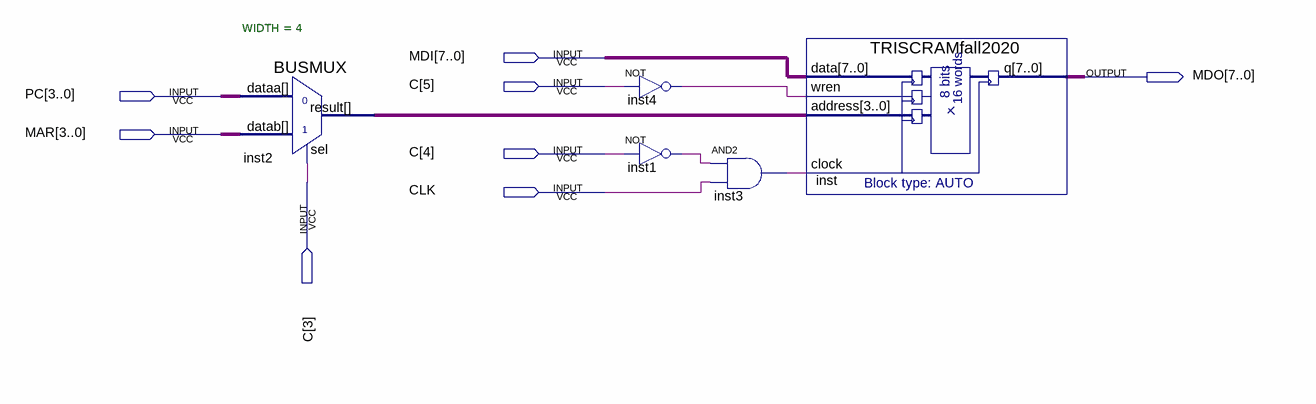
[diagram p0: schematic sheet]
// Quartus schematic TRISCRAM.bdf as structural Verilog: 5 symbols, 8 pins
module TRISCRAM (
  input  [7:0] MDI,
  input  [5:3] C,
  input  [3:0] PC,
  input  [3:0] MAR,
  input  CLK,
  output [7:0] MDO
);

  wire inst1_out, inst3_out, inst4_out;
  wire [3:0] inst2_result;

  BUSMUX #(.WIDTH(4)) inst2 (.datab(MAR), .sel(C[3]), .dataa(PC), .result(inst2_result));
  not inst4 (inst4_out, C[5]);
  not inst1 (inst1_out, C[4]);
  and inst3 (inst3_out, inst1_out, CLK);
  TRISCRAMfall2020 inst (.data(MDI), .wren(inst4_out), .address(inst2_result), .clock(inst3_out), .q(MDO));
endmodule
